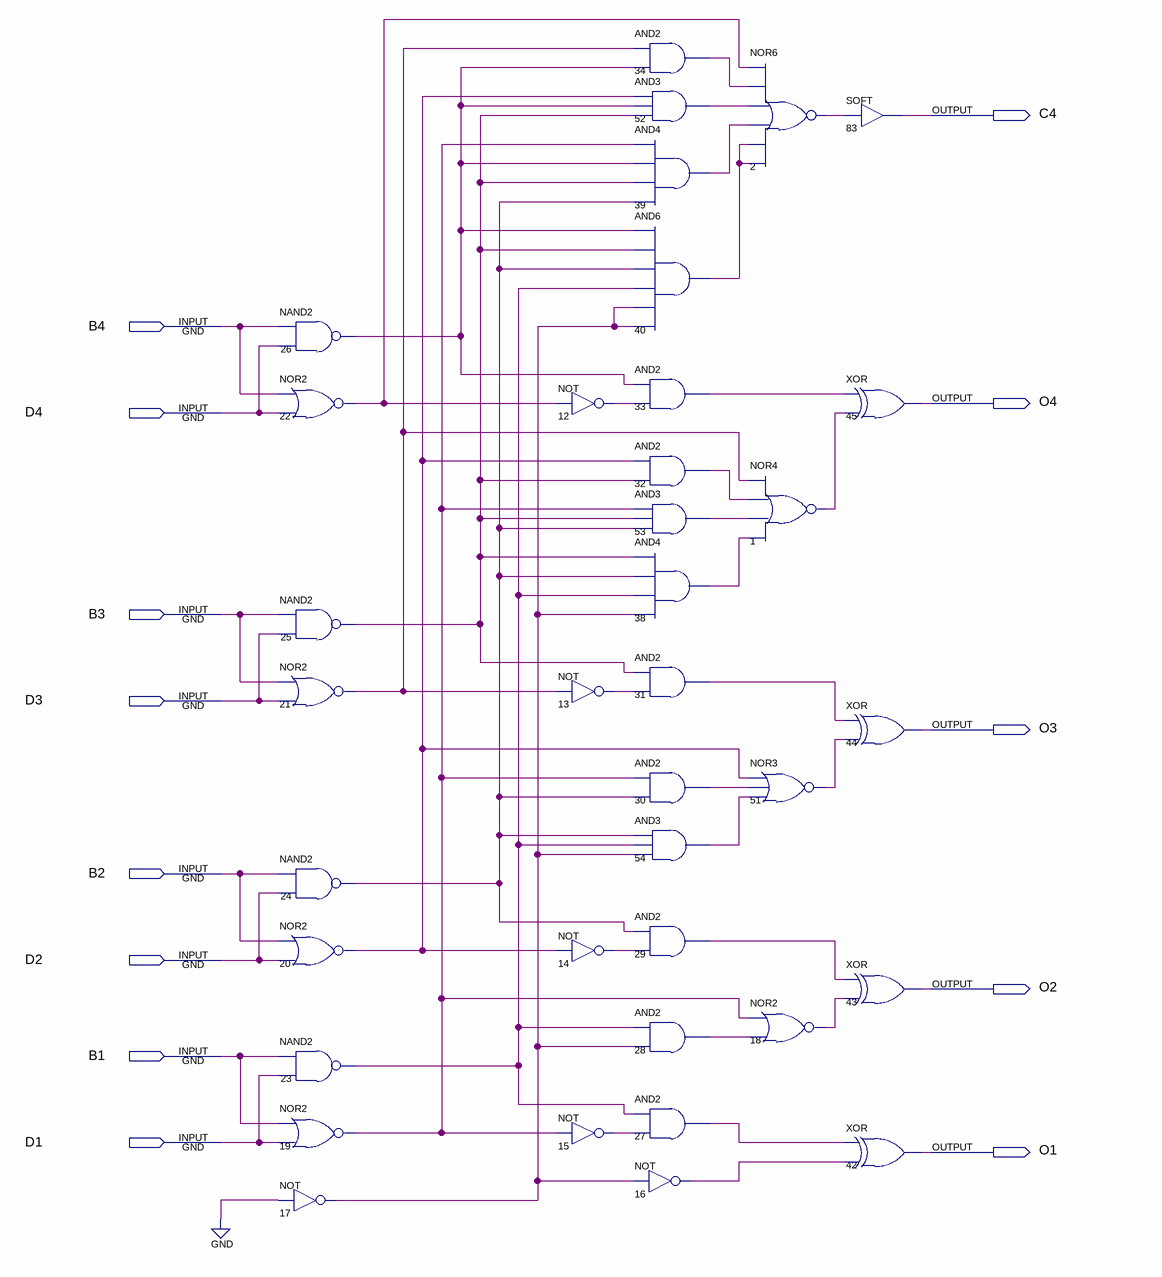
[diagram p0: schematic sheet]
// Quartus schematic binary_to_BCD.bdf as structural Verilog: 37 symbols, 13 pins
module binary_to_BCD (
  input  B4,
  input  D4,
  input  B3,
  input  D3,
  input  B2,
  input  D2,
  input  B1,
  input  D1,
  output C4,
  output O4,
  output O3,
  output O2,
  output O1
);

  wire n1_out, n2_out, n12_out, n13_out, n14_out, n15_out, n16_out, n17_out, n18_out, n19_out, n20_out,
       n21_out, n22_out, n23_out, n24_out, n25_out, n26_out, n27_out, n28_out, n29_out, n30_out, n31_out,
       n32_out, n33_out, n34_out, n38_out, n39_out, n40_out, n51_out, n52_out, n53_out, n54_out;

  nand u_26 (n26_out, B4, D4);
  nor u_22 (n22_out, B4, D4);
  nand u_25 (n25_out, B3, D3);
  nor u_21 (n21_out, B3, D3);
  nand u_24 (n24_out, B2, D2);
  nor u_20 (n20_out, B2, D2);
  nand u_23 (n23_out, B1, D1);
  nor u_19 (n19_out, B1, D1);
  not u_17 (n17_out, 1'b0);
  not u_12 (n12_out, n22_out);
  not u_13 (n13_out, n21_out);
  not u_14 (n14_out, n20_out);
  not u_15 (n15_out, n19_out);
  and u_34 (n34_out, n21_out, n26_out);
  and u_52 (n52_out, n20_out, n26_out, n25_out);
  and u_39 (n39_out, n19_out, n26_out, n25_out, n24_out);
  and u_40 (n40_out, n26_out, n25_out, n24_out, n23_out, n17_out, n17_out);
  and u_33 (n33_out, n26_out, n12_out);
  and u_32 (n32_out, n20_out, n25_out);
  and u_53 (n53_out, n19_out, n25_out, n24_out);
  and u_38 (n38_out, n25_out, n24_out, n23_out, n17_out);
  and u_31 (n31_out, n25_out, n13_out);
  and u_30 (n30_out, n19_out, n24_out);
  and u_54 (n54_out, n24_out, n23_out, n17_out);
  and u_29 (n29_out, n24_out, n14_out);
  and u_28 (n28_out, n23_out, n17_out);
  and u_27 (n27_out, n23_out, n15_out);
  not u_16 (n16_out, n17_out);
  nor u_2 (n2_out, n22_out, n34_out, n52_out, n39_out, n40_out, n40_out);
  nor u_1 (n1_out, n21_out, n32_out, n53_out, n38_out);
  nor u_51 (n51_out, n20_out, n30_out, n54_out);
  nor u_18 (n18_out, n19_out, n28_out);
  SOFT u_83 (.IN(n2_out), .OUT(C4));
  xor u_45 (O4, n33_out, n1_out);
  xor u_44 (O3, n31_out, n51_out);
  xor u_43 (O2, n29_out, n18_out);
  xor u_42 (O1, n27_out, n16_out);
endmodule
